# Altium project led_board.PrjPcb
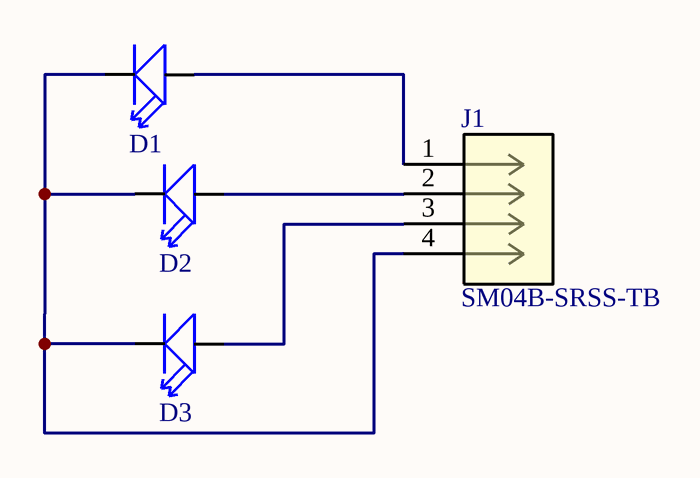
[diagram p0: led_board.SchDoc]
1 sheet, 4 parts. Net scope: global (net labels, ports and power ports of the same name join across sheets).
Board file: led_board.PcbDoc

## Sheet led_board.SchDoc
size A4; SheetNumber: 1; SheetTotal: 1

### Parts
D1  LED  [LEDM1608X80]  (value not drawn)
D2  LED  [LEDM1608X80]  (value not drawn)
D3  LED  [LEDM1608X80]  (value not drawn)
J1  SM04B-SRSS-TB  [CONN_SM04B-SRSS-TB_JST]

### Nets
NetD1_A: D1.A J1.1
NetD1_C: D1.C D2.C D3.C J1.4
NetD2_A: D2.A J1.2
NetD3_A: D3.A J1.3

### Library data of the parts
D1-D3 = LTST-C190KFKT: Single Color LED, Ultra Bright Orange, Water Clear, 1.1mm; Manufacturer: Vishay Lite-On; Lens Color: Colorless; Power Rating: 75mW; Luminous Intensity: 90mcd; Viewing Angle: 130°; Forward Current: 30mA; Forward Voltage: 2V; Lens Style: Flat,Diffused,Colorless,Rectangular,Clear; Dominant Wavelength: 605nm; Test Current: 20mA; Number of Elements: 1; Reverse Voltage: 5V; Voltage Rating: 50V; Resistance: 47kR; Tolerance: 1%; Lens Size: 0.8mm; Supplier 1: Digikey; Manufacturer Part Number: LTST-C190KFKT; RoHS: Yes; Category: LEDs; Stock 1: 96032; Pricing 1: 1=0.13, 10=0.089, 100=0.0613, 500=0.0484, 1000=0.0441, 2000=0.04042 (USD); Mount: Surface Mount; Case/Package: 0603; Number of Pins: 2; Color: Orange; Case Code (Metric): 1608; Case Code (Imperial): 0603; Min Operating Temperature: -55°C; Max Operating Temperature: 85°C; Packaging: Tape and Reel; Package Quantity: 3000; Illumination Color: Orange; Lens Transparency: Clear; Power Dissipation: 75mW; Wavelength: 605nm; Number of LEDs: 1; Series: -; Voltage Rating (DC): 50V; Length: 3.2mm; Width: 0.8mm; Height: 0.9mm; Depth: 1.6mm; Radiation Hardening: No; Lead Free: Lead Free; RoHS Compliant: Yes; Reach SVHC Compliant: 4186SVHC; ComponentLink1URL: https://datasheet.ciiva.com/11774/0900766b80dc02a7-11774744.pdf?src-supplier=Rs; ComponentLink1Description: https://datasheet.ciiva.com/11774/0900766b80dc02a7-11774744.pdf?src-supplier=Rs; ComponentLink2URL: https://datasheet.ciiva.com/15201/getdatasheetpartid-309341-15201388.pdf?src-supplier=Verical; ComponentLink2Description: https://datasheet.ciiva.com/15201/getdatasheetpartid-309341-15201388.pdf?src-supplier=Verical; ComponentLink3URL: https://datasheet.ciiva.com/16396/lite-on20ltst-c190kfkt-16396246.pdf?src-supplier=Future+Electronics; ComponentLink3Description: https://datasheet.ciiva.com/16396/lite-on20ltst-c190kfkt-16396246.pdf?src-supplier=Future+Electronics; ComponentLink4URL: https://datasheet.ciiva.com/12400/100-ltst-c190kfkt-53640-12400769.pdf?src-supplier=Mouser; ComponentLink4Description: https://datasheet.ciiva.com/12400/100-ltst-c190kfkt-53640-12400769.pdf?src-supplier=Mouser; ComponentLink5URL: https://datasheet.ciiva.com/2109/s-110-ltst-c190kfkt-2109976.pdf?src-supplier=Digikey; ComponentLink5Description: https://datasheet.ciiva.com/2109/s-110-ltst-c190kfkt-2109976.pdf?src-supplier=Digikey; ComponentLink6URL: https://datasheet.ciiva.com/2109/s-110-ltst-c190kfkt-2109977.pdf?src-supplier=Digikey; ComponentLink6Description: https://datasheet.ciiva.com/2109/s-110-ltst-c190kfkt-2109977.pdf?src-supplier=Digikey; ComponentLink7URL: https://datasheet.ciiva.com/2109/s-110-ltst-c190kfkt-2109978.pdf?src-supplier=Digikey; ComponentLink7Description: https://datasheet.ciiva.com/2109/s-110-ltst-c190kfkt-2109978.pdf?src-supplier=Digikey; Supplier Part Number 1: 160-1434-1-ND
J1 = SM04B-SRSS-TB: No Description Available; Manufacturer_Name: JST; Copyright: Copyright (C) 2025 Ultra Librarian. All rights reserved.; Manufacturer_Part_Number: SM04B-SRSS-TB; RefDes: RefDes; Type: Type; Supplier Part Number 1: 455-SM04B-SRSS-TBTR-ND